# Altium project ST14_POWER.PrjPcb
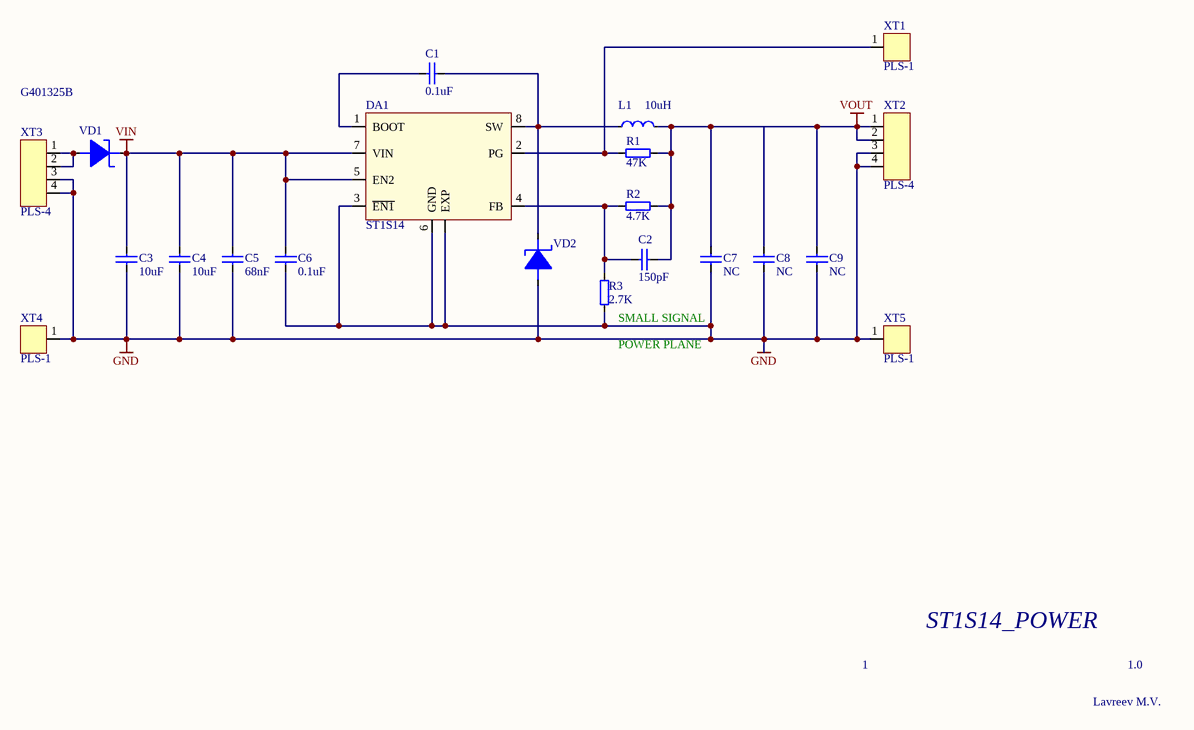
[diagram p0: ST14_POWER.SchDoc]
1 sheet, 21 parts. Net scope: global (net labels, ports and power ports of the same name join across sheets).
Board file: ST14_POWER.PcbDoc

## Sheet ST14_POWER.SchDoc
size A4

### Parts
C1  0.1uF  [C0805]
C2  150pF  [C0805]
C3  10uF  [C1210]
C4  10uF  [C1210]
C5  68nF  [C0805]
C6  0.1uF  [C0805]
C7  NC  [C1210]
C8  NC  [C0805]
C9  NC  [C1210]
DA1  ST1S14  [SO-8EPAD]
L1  10uH  [MSS7341]
R1  47K  [R0805]
R2  4.7K  [R0805]
R3  2.7K  [R0805]
VD1  1N5819  [Diode SMB]  (value not drawn)
VD2  1N5819  [Diode SMB]  (value not drawn)
XT1  PLS-1  [PLS-1_1]
XT2  PLS-4  [PLS-4_1]
XT3  PLS-4  [PLS-4_1]
XT4  PLS-1  [PLS-1_1]
XT5  PLS-1  [PLS-1_1]

### Nets
GND: C3.1 C4.1 C5.1 C6.1 C7.1 C8.1 C9.1 DA1.0(EXP) DA1.3(~{EN1}) DA1.6(GND) R3.1 VD2.1(A) XT2.3 XT2.4 XT3.3 XT3.4 XT4.1 XT5.1
VIN: C3.2 C4.2 C5.2 C6.2 DA1.5(EN2) DA1.7(VIN) VD1.2(C)
VOUT: C2.2 C7.2 C8.2 C9.2 L1.1 R1.2 R2.2 XT2.1 XT2.2
NetC1_1: C1.1 DA1.1(BOOT)
NetC1_2: C1.2 DA1.8(SW) L1.2 VD2.2(C)
NetC2_1: C2.1 DA1.4(FB) R2.1 R3.2
NetDA1_2: DA1.2(PG) R1.1 XT1.1
NetVD1_1: VD1.1(A) XT3.1 XT3.2

### Notes on the sheet
- G401325B
- (near R3) POWER PLANE
- (near R3) SMALL SIGNAL
- ST1S14_POWER
- 1
- 1.0
- Lavreev M.V.

### Library data of the parts
C1-C9 = C: Capacitor
  C1 C6: Value: 0.1uF
  C2: Value: 150pF
  C3 C4: Value: 10uF
  C5: Value: 68nF
  C7-C9: Value: NC
DA1 = ST1S14: Up to 3 A step-down switching regulator; Value: ST1S14
L1 = L: Inductor; Code_IEC: 1005; Published: 8-Jun-2000; LatestRevisionDate: 17-Jul-2002; LatestRevisionNote: Re-released for DXP Platform.; PackageReference: 0402-A; Publisher: Altium Limited; Code_JEITA: 0402; Value: 10uH
R1-R3 = R: Resistor
  R1: Value: 47K
  R2: Value: 4.7K
  R3: Value: 2.7K
VD1 VD2 = Diode Shottky: Diode; Value: 1N5819
XT1 XT4 XT5 = PLS-1: Pin Header Pitch 2.54mm 1 Pin; Value: PLS-1
XT2 XT3 = PLS-4: Pin Header Pitch 2.54mm 4pins; Value: PLS-4